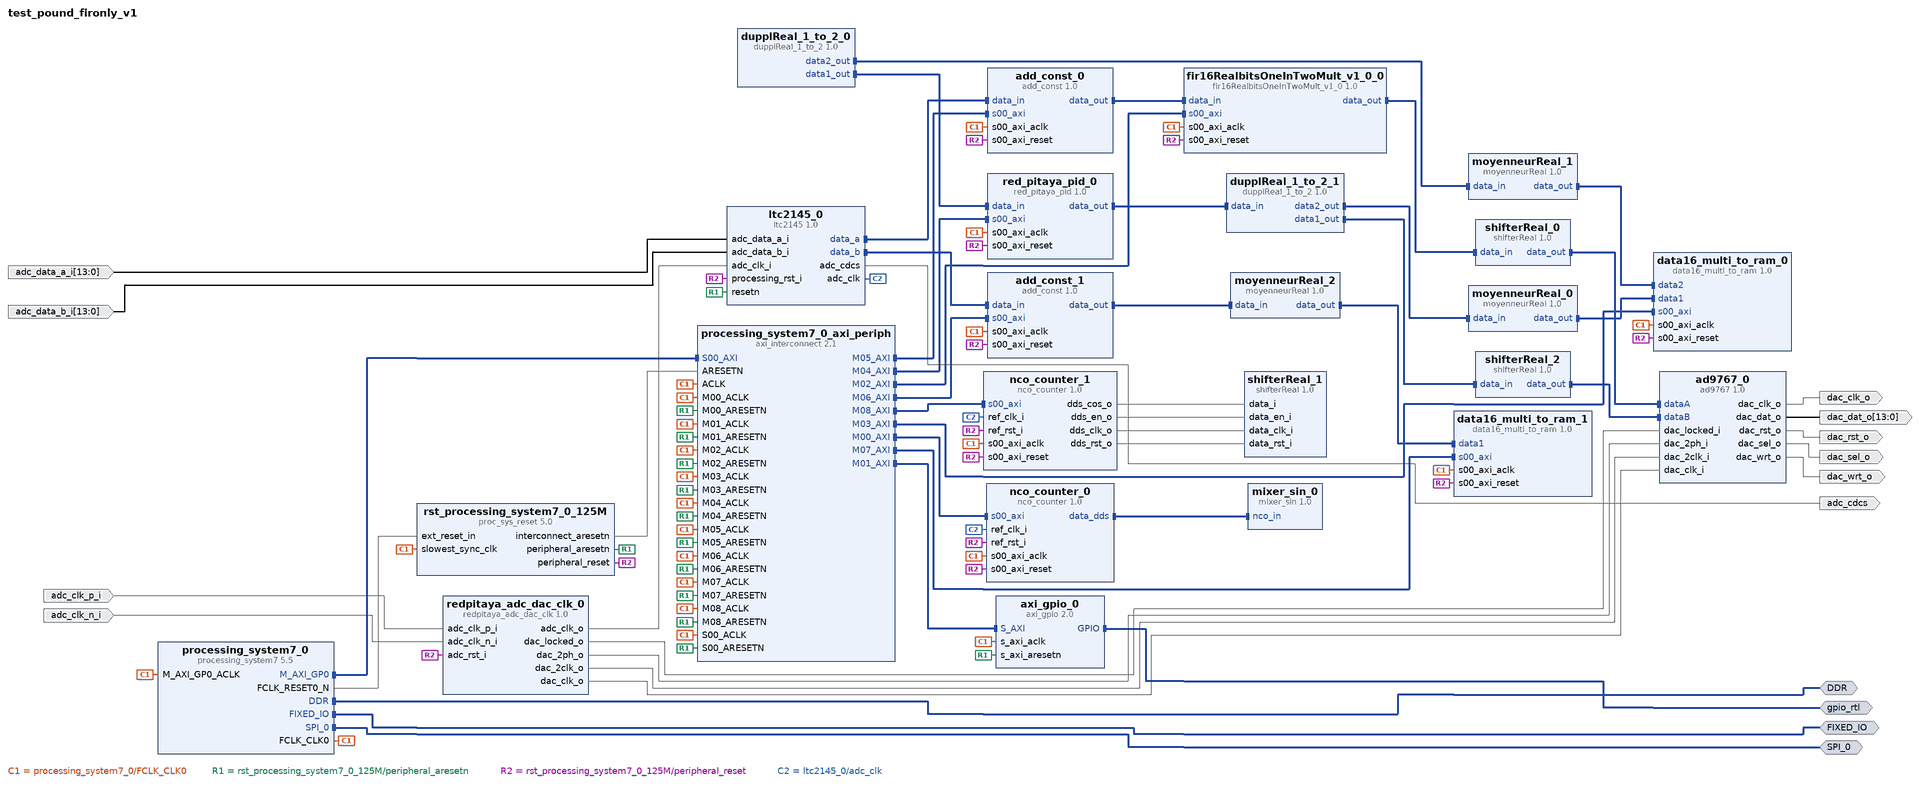
[diagram p0: block diagram of the top level]
# Vivado block design test_pound_fironly_v1, Vivado 2016.2
create_bd_design test_pound_fironly_v1

create_bd_intf_port -mode Master -vlnv xilinx.com:interface:ddrx_rtl:1.0 DDR
create_bd_intf_port -mode Master -vlnv xilinx.com:display_processing_system7:fixedio_rtl:1.0 FIXED_IO
create_bd_intf_port -mode Master -vlnv xilinx.com:interface:gpio_rtl:1.0 gpio_rtl
create_bd_intf_port -mode Master -vlnv xilinx.com:interface:spi_rtl:1.0 SPI_0
create_bd_port -dir O adc_cdcs
create_bd_port -dir I -from 13 -to 0 adc_data_a_i
create_bd_port -dir I -from 13 -to 0 adc_data_b_i
create_bd_port -dir I adc_clk_p_i
create_bd_port -dir I adc_clk_n_i
create_bd_port -dir O -from 13 -to 0 dac_dat_o
create_bd_port -dir O dac_wrt_o
create_bd_port -dir O dac_sel_o
create_bd_port -dir O dac_clk_o
create_bd_port -dir O dac_rst_o

create_bd_cell -type ip -vlnv xilinx.com:ip:processing_system7:5.5 processing_system7_0
set_property -dict [list \
  CONFIG.PCW_FCLK_CLK0_BUF true \
  CONFIG.PCW_FCLK_CLK1_BUF true \
  CONFIG.PCW_FCLK_CLK2_BUF true \
  CONFIG.PCW_FCLK_CLK3_BUF true \
  CONFIG.PCW_UIPARAM_DDR_FREQ_MHZ 533.333333 \
  CONFIG.PCW_APU_PERIPHERAL_FREQMHZ 666.666666 \
  CONFIG.PCW_FPGA0_PERIPHERAL_FREQMHZ 125 \
  CONFIG.PCW_FPGA1_PERIPHERAL_FREQMHZ 250 \
  CONFIG.PCW_FPGA3_PERIPHERAL_FREQMHZ 200 \
  CONFIG.PCW_M_AXI_GP0_FREQMHZ 125 \
  CONFIG.PCW_EN_CLK1_PORT 1 \
  CONFIG.PCW_EN_CLK2_PORT 1 \
  CONFIG.PCW_EN_CLK3_PORT 1 \
  CONFIG.PCW_EN_RST1_PORT 1 \
  CONFIG.PCW_EN_RST2_PORT 1 \
  CONFIG.PCW_EN_RST3_PORT 1 \
  CONFIG.PCW_SPI0_PERIPHERAL_ENABLE 1 \
  CONFIG.PCW_SPI1_PERIPHERAL_ENABLE 1 \
  CONFIG.PCW_SPI1_SPI1_IO {MIO 10 .. 15} \
  CONFIG.PCW_SPI1_GRP_SS1_ENABLE 1 \
  CONFIG.PCW_SPI1_GRP_SS2_ENABLE 1 \
] [get_bd_cells processing_system7_0]
# 151 more settings of processing_system7_0 are not shown: defaults, MIO pin electricals, DDR timing, and values the tool derives
create_bd_cell -type ip -vlnv xilinx.com:ip:axi_interconnect:2.1 processing_system7_0_axi_periph
set_property -dict {CONFIG.NUM_MI 9} [get_bd_cells processing_system7_0_axi_periph]
create_bd_cell -type ip -vlnv xilinx.com:ip:proc_sys_reset:5.0 rst_processing_system7_0_125M
create_bd_cell -type ip -vlnv xilinx.com:ip:axi_gpio:2.0 axi_gpio_0
set_property -dict {CONFIG.C_GPIO_WIDTH 4 CONFIG.C_ALL_OUTPUTS 1} [get_bd_cells axi_gpio_0]
create_bd_cell -type ip -vlnv ggm:cogen:redpitaya_adc_dac_clk:1.0 redpitaya_adc_dac_clk_0
create_bd_cell -type ip -vlnv ggm:cogen:mixer_sin:1.0 mixer_sin_0
set_property -dict {CONFIG.DATA_SIZE 14} [get_bd_cells mixer_sin_0]
create_bd_cell -type ip -vlnv ggm:cogen:ad9767:1.0 ad9767_0
create_bd_cell -type ip -vlnv ggm:cogen:fir16RealbitsOneInTwoMult_v1_0:1.0 fir16RealbitsOneInTwoMult_v1_0_0
set_property -dict [list \
  CONFIG.NB_FIR 13 \
  CONFIG.DECIMATE_FACTOR 10 \
  CONFIG.DATA_IN_SIZE 14 \
  CONFIG.DATA_OUT_SIZE 31 \
] [get_bd_cells fir16RealbitsOneInTwoMult_v1_0_0]
create_bd_cell -type ip -vlnv gwbs:user:ltc2145:1.0 ltc2145_0
create_bd_cell -type ip -vlnv ggm:cogen:shifterReal:1.0 shifterReal_0
set_property -dict {CONFIG.DATA_OUT_SIZE 14 CONFIG.DATA_IN_SIZE 30} [get_bd_cells shifterReal_0]
create_bd_cell -type ip -vlnv user.org:user:red_pitaya_pid:1.0 red_pitaya_pid_0
set_property -dict {CONFIG.DATA_SIZE 16} [get_bd_cells red_pitaya_pid_0]
create_bd_cell -type ip -vlnv ggm:cogen:add_const:1.0 add_const_0
set_property -dict {CONFIG.DATA_OUT_SIZE 14 CONFIG.DATA_IN_SIZE 14} [get_bd_cells add_const_0]
create_bd_cell -type ip -vlnv ggm:cogen:add_const:1.0 add_const_1
set_property -dict {CONFIG.DATA_OUT_SIZE 14 CONFIG.DATA_IN_SIZE 14} [get_bd_cells add_const_1]
create_bd_cell -type ip -vlnv ggm:cogen:shifterReal:1.0 shifterReal_1
set_property -dict {CONFIG.DATA_OUT_SIZE 14 CONFIG.DATA_IN_SIZE 16} [get_bd_cells shifterReal_1]
create_bd_cell -type ip -vlnv ggm:cogen:dupplReal_1_to_2:1.0 dupplReal_1_to_2_0
set_property -dict {CONFIG.DATA_SIZE 16} [get_bd_cells dupplReal_1_to_2_0]
create_bd_cell -type ip -vlnv ggm:cogen:shifterReal:1.0 shifterReal_2
set_property -dict {CONFIG.DATA_OUT_SIZE 14 CONFIG.DATA_IN_SIZE 16} [get_bd_cells shifterReal_2]
create_bd_cell -type ip -vlnv ggm:cogen:dupplReal_1_to_2:1.0 dupplReal_1_to_2_1
set_property -dict {CONFIG.DATA_SIZE 16} [get_bd_cells dupplReal_1_to_2_1]
create_bd_cell -type ip -vlnv ggm:cogen:moyenneurReal:1.0 moyenneurReal_0
set_property -dict {CONFIG.nb_accum 65536 CONFIG.shift 16 CONFIG.OUTPUT_DATA_SIZE 16} [get_bd_cells moyenneurReal_0]
create_bd_cell -type ip -vlnv ggm:cogen:moyenneurReal:1.0 moyenneurReal_1
set_property -dict {CONFIG.nb_accum 65536 CONFIG.shift 16 CONFIG.OUTPUT_DATA_SIZE 16} [get_bd_cells moyenneurReal_1]
create_bd_cell -type ip -vlnv ggm:cogen:moyenneurReal:1.0 moyenneurReal_2
set_property -dict {CONFIG.nb_accum 65536 CONFIG.shift 16 CONFIG.OUTPUT_DATA_SIZE 16} [get_bd_cells moyenneurReal_2]
create_bd_cell -type ip -vlnv user.org:user:nco_counter:1.0 nco_counter_0
set_property -dict {CONFIG.COUNTER_SIZE 32} [get_bd_cells nco_counter_0]
create_bd_cell -type ip -vlnv user.org:user:nco_counter:1.0 nco_counter_1
set_property -dict {CONFIG.COUNTER_SIZE 32} [get_bd_cells nco_counter_1]
create_bd_cell -type ip -vlnv ggm:cogen:data16_multi_to_ram:1.0 data16_multi_to_ram_0
set_property -dict {CONFIG.NB_INPUT 2 CONFIG.ADDR_SIZE 1} [get_bd_cells data16_multi_to_ram_0]
create_bd_cell -type ip -vlnv ggm:cogen:data16_multi_to_ram:1.0 data16_multi_to_ram_1
set_property -dict {CONFIG.NB_INPUT 1 CONFIG.ADDR_SIZE 1} [get_bd_cells data16_multi_to_ram_1]

# ---- connections ----

connect_bd_intf_net [get_bd_intf_pins processing_system7_0/M_AXI_GP0] [get_bd_intf_pins processing_system7_0_axi_periph/S00_AXI]
connect_bd_intf_net [get_bd_intf_pins processing_system7_0_axi_periph/M01_AXI] [get_bd_intf_pins axi_gpio_0/S_AXI]
connect_bd_intf_net [get_bd_intf_pins processing_system7_0_axi_periph/M02_AXI] [get_bd_intf_pins fir16RealbitsOneInTwoMult_v1_0_0/s00_axi]
connect_bd_intf_net [get_bd_intf_pins shifterReal_0/data_in] [get_bd_intf_pins fir16RealbitsOneInTwoMult_v1_0_0/data_out]
connect_bd_intf_net [get_bd_intf_pins add_const_0/data_in] [get_bd_intf_pins ltc2145_0/data_a]
connect_bd_intf_net [get_bd_intf_pins ltc2145_0/data_b] [get_bd_intf_pins add_const_1/data_in]
connect_bd_intf_net [get_bd_intf_pins dupplReal_1_to_2_1/data1_out] [get_bd_intf_pins shifterReal_2/data_in]
connect_bd_intf_net [get_bd_intf_pins shifterReal_2/data_out] [get_bd_intf_pins ad9767_0/dataB]
connect_bd_intf_net [get_bd_intf_pins dupplReal_1_to_2_0/data1_out] [get_bd_intf_pins red_pitaya_pid_0/data_in]
connect_bd_intf_net [get_bd_intf_pins red_pitaya_pid_0/data_out] [get_bd_intf_pins dupplReal_1_to_2_1/data_in]
connect_bd_intf_net [get_bd_intf_pins processing_system7_0_axi_periph/M04_AXI] [get_bd_intf_pins red_pitaya_pid_0/s00_axi]
connect_bd_intf_net [get_bd_intf_pins processing_system7_0_axi_periph/M05_AXI] [get_bd_intf_pins add_const_0/s00_axi]
connect_bd_intf_net [get_bd_intf_pins processing_system7_0_axi_periph/M06_AXI] [get_bd_intf_pins add_const_1/s00_axi]
connect_bd_intf_net [get_bd_intf_pins moyenneurReal_0/data_in] [get_bd_intf_pins dupplReal_1_to_2_1/data2_out]
connect_bd_intf_net [get_bd_intf_pins moyenneurReal_2/data_in] [get_bd_intf_pins add_const_1/data_out]
connect_bd_intf_net [get_bd_intf_pins processing_system7_0_axi_periph/M03_AXI] [get_bd_intf_pins data16_multi_to_ram_0/s00_axi]
connect_bd_intf_net [get_bd_intf_pins data16_multi_to_ram_0/data1] [get_bd_intf_pins moyenneurReal_0/data_out]
connect_bd_intf_net [get_bd_intf_pins data16_multi_to_ram_0/data2] [get_bd_intf_pins moyenneurReal_1/data_out]
connect_bd_intf_net [get_bd_intf_pins processing_system7_0_axi_periph/M07_AXI] [get_bd_intf_pins data16_multi_to_ram_1/s00_axi]
connect_bd_intf_net [get_bd_intf_pins data16_multi_to_ram_1/data1] [get_bd_intf_pins moyenneurReal_2/data_out]
connect_bd_intf_net [get_bd_intf_pins processing_system7_0_axi_periph/M00_AXI] [get_bd_intf_pins nco_counter_0/s00_axi]
connect_bd_intf_net [get_bd_intf_pins processing_system7_0_axi_periph/M08_AXI] [get_bd_intf_pins nco_counter_1/s00_axi]
connect_bd_intf_net [get_bd_intf_pins nco_counter_0/data_dds] [get_bd_intf_pins mixer_sin_0/nco_in]
connect_bd_intf_net [get_bd_intf_pins dupplReal_1_to_2_0/data2_out] [get_bd_intf_pins moyenneurReal_1/data_in]
connect_bd_intf_net [get_bd_intf_pins add_const_0/data_out] [get_bd_intf_pins fir16RealbitsOneInTwoMult_v1_0_0/data_in]
connect_bd_intf_net [get_bd_intf_pins shifterReal_0/data_out] [get_bd_intf_pins ad9767_0/dataA]
connect_bd_intf_net [get_bd_intf_ports DDR] [get_bd_intf_pins processing_system7_0/DDR]
connect_bd_intf_net [get_bd_intf_ports FIXED_IO] [get_bd_intf_pins processing_system7_0/FIXED_IO]
connect_bd_intf_net [get_bd_intf_ports gpio_rtl] [get_bd_intf_pins axi_gpio_0/GPIO]
connect_bd_intf_net [get_bd_intf_ports SPI_0] [get_bd_intf_pins processing_system7_0/SPI_0]
connect_bd_net [get_bd_pins processing_system7_0/FCLK_CLK0] \
  [get_bd_pins processing_system7_0/M_AXI_GP0_ACLK] [get_bd_pins rst_processing_system7_0_125M/slowest_sync_clk] \
  [get_bd_pins axi_gpio_0/s_axi_aclk] [get_bd_pins fir16RealbitsOneInTwoMult_v1_0_0/s00_axi_aclk] \
  [get_bd_pins red_pitaya_pid_0/s00_axi_aclk] [get_bd_pins add_const_0/s00_axi_aclk] [get_bd_pins add_const_1/s00_axi_aclk] \
  [get_bd_pins nco_counter_0/s00_axi_aclk] [get_bd_pins nco_counter_1/s00_axi_aclk] \
  [get_bd_pins processing_system7_0_axi_periph/S00_ACLK] [get_bd_pins processing_system7_0_axi_periph/ACLK] \
  [get_bd_pins processing_system7_0_axi_periph/M00_ACLK] [get_bd_pins processing_system7_0_axi_periph/M01_ACLK] \
  [get_bd_pins processing_system7_0_axi_periph/M02_ACLK] [get_bd_pins processing_system7_0_axi_periph/M03_ACLK] \
  [get_bd_pins processing_system7_0_axi_periph/M04_ACLK] [get_bd_pins processing_system7_0_axi_periph/M05_ACLK] \
  [get_bd_pins processing_system7_0_axi_periph/M06_ACLK] [get_bd_pins processing_system7_0_axi_periph/M07_ACLK] \
  [get_bd_pins processing_system7_0_axi_periph/M08_ACLK] [get_bd_pins data16_multi_to_ram_0/s00_axi_aclk] \
  [get_bd_pins data16_multi_to_ram_1/s00_axi_aclk]
connect_bd_net [get_bd_pins processing_system7_0/FCLK_RESET0_N] [get_bd_pins rst_processing_system7_0_125M/ext_reset_in]
connect_bd_net [get_bd_pins rst_processing_system7_0_125M/peripheral_aresetn] \
  [get_bd_pins axi_gpio_0/s_axi_aresetn] [get_bd_pins ltc2145_0/resetn] \
  [get_bd_pins processing_system7_0_axi_periph/S00_ARESETN] [get_bd_pins processing_system7_0_axi_periph/M00_ARESETN] \
  [get_bd_pins processing_system7_0_axi_periph/M01_ARESETN] [get_bd_pins processing_system7_0_axi_periph/M02_ARESETN] \
  [get_bd_pins processing_system7_0_axi_periph/M03_ARESETN] [get_bd_pins processing_system7_0_axi_periph/M04_ARESETN] \
  [get_bd_pins processing_system7_0_axi_periph/M05_ARESETN] [get_bd_pins processing_system7_0_axi_periph/M06_ARESETN] \
  [get_bd_pins processing_system7_0_axi_periph/M07_ARESETN] [get_bd_pins processing_system7_0_axi_periph/M08_ARESETN]
connect_bd_net [get_bd_pins rst_processing_system7_0_125M/interconnect_aresetn] [get_bd_pins processing_system7_0_axi_periph/ARESETN]
connect_bd_net [get_bd_pins redpitaya_adc_dac_clk_0/dac_locked_o] [get_bd_pins ad9767_0/dac_locked_i]
connect_bd_net [get_bd_pins redpitaya_adc_dac_clk_0/dac_2ph_o] [get_bd_pins ad9767_0/dac_2ph_i]
connect_bd_net [get_bd_pins redpitaya_adc_dac_clk_0/dac_2clk_o] [get_bd_pins ad9767_0/dac_2clk_i]
connect_bd_net [get_bd_pins redpitaya_adc_dac_clk_0/dac_clk_o] [get_bd_pins ad9767_0/dac_clk_i]
connect_bd_net [get_bd_pins ltc2145_0/adc_cdcs] [get_bd_ports adc_cdcs]
connect_bd_net [get_bd_ports adc_data_a_i] [get_bd_pins ltc2145_0/adc_data_a_i]
connect_bd_net [get_bd_ports adc_data_b_i] [get_bd_pins ltc2145_0/adc_data_b_i]
connect_bd_net [get_bd_pins redpitaya_adc_dac_clk_0/adc_clk_o] [get_bd_pins ltc2145_0/adc_clk_i]
connect_bd_net [get_bd_pins rst_processing_system7_0_125M/peripheral_reset] \
  [get_bd_pins redpitaya_adc_dac_clk_0/adc_rst_i] [get_bd_pins fir16RealbitsOneInTwoMult_v1_0_0/s00_axi_reset] \
  [get_bd_pins red_pitaya_pid_0/s00_axi_reset] [get_bd_pins add_const_0/s00_axi_reset] \
  [get_bd_pins add_const_1/s00_axi_reset] [get_bd_pins ltc2145_0/processing_rst_i] [get_bd_pins nco_counter_0/s00_axi_reset] \
  [get_bd_pins nco_counter_1/s00_axi_reset] [get_bd_pins nco_counter_0/ref_rst_i] [get_bd_pins nco_counter_1/ref_rst_i] \
  [get_bd_pins data16_multi_to_ram_0/s00_axi_reset] [get_bd_pins data16_multi_to_ram_1/s00_axi_reset]
connect_bd_net [get_bd_ports adc_clk_p_i] [get_bd_pins redpitaya_adc_dac_clk_0/adc_clk_p_i]
connect_bd_net [get_bd_ports adc_clk_n_i] [get_bd_pins redpitaya_adc_dac_clk_0/adc_clk_n_i]
connect_bd_net [get_bd_pins ad9767_0/dac_dat_o] [get_bd_ports dac_dat_o]
connect_bd_net [get_bd_pins ad9767_0/dac_wrt_o] [get_bd_ports dac_wrt_o]
connect_bd_net [get_bd_pins ad9767_0/dac_sel_o] [get_bd_ports dac_sel_o]
connect_bd_net [get_bd_pins ad9767_0/dac_clk_o] [get_bd_ports dac_clk_o]
connect_bd_net [get_bd_pins ad9767_0/dac_rst_o] [get_bd_ports dac_rst_o]
connect_bd_net [get_bd_pins ltc2145_0/adc_clk] [get_bd_pins nco_counter_1/ref_clk_i] [get_bd_pins nco_counter_0/ref_clk_i]
connect_bd_net [get_bd_pins nco_counter_1/dds_cos_o] [get_bd_pins shifterReal_1/data_i]
connect_bd_net [get_bd_pins nco_counter_1/dds_en_o] [get_bd_pins shifterReal_1/data_en_i]
connect_bd_net [get_bd_pins nco_counter_1/dds_clk_o] [get_bd_pins shifterReal_1/data_clk_i]
connect_bd_net [get_bd_pins nco_counter_1/dds_rst_o] [get_bd_pins shifterReal_1/data_rst_i]

# ---- address map ----
assign_bd_address -offset 0x41200000 -range 64K -target_address_space [get_bd_addr_spaces processing_system7_0/Data] [get_bd_addr_segs axi_gpio_0/S_AXI/Reg]
assign_bd_address -offset 0x43C00000 -range 64K -target_address_space [get_bd_addr_spaces processing_system7_0/Data] [get_bd_addr_segs nco_counter_0/s00_axi/reg0]
assign_bd_address -offset 0x43C10000 -range 64K -target_address_space [get_bd_addr_spaces processing_system7_0/Data] [get_bd_addr_segs fir16RealbitsOneInTwoMult_v1_0_0/s00_axi/reg0]
assign_bd_address -offset 0x43C20000 -range 64K -target_address_space [get_bd_addr_spaces processing_system7_0/Data] [get_bd_addr_segs data16_multi_to_ram_0/s00_axi/reg0]
assign_bd_address -offset 0x43C30000 -range 64K -target_address_space [get_bd_addr_spaces processing_system7_0/Data] [get_bd_addr_segs red_pitaya_pid_0/s00_axi/reg0]
assign_bd_address -offset 0x43C40000 -range 64K -target_address_space [get_bd_addr_spaces processing_system7_0/Data] [get_bd_addr_segs add_const_0/s00_axi/reg0]
assign_bd_address -offset 0x43C50000 -range 64K -target_address_space [get_bd_addr_spaces processing_system7_0/Data] [get_bd_addr_segs add_const_1/s00_axi/reg0]
assign_bd_address -offset 0x43C60000 -range 64K -target_address_space [get_bd_addr_spaces processing_system7_0/Data] [get_bd_addr_segs data16_multi_to_ram_1/s00_axi/reg0]
assign_bd_address -offset 0x43C70000 -range 64K -target_address_space [get_bd_addr_spaces processing_system7_0/Data] [get_bd_addr_segs nco_counter_1/s00_axi/reg0]

validate_bd_design
save_bd_design
